# Altium schematic sheet TLogicWindow.schDOC
size A3; Organization: Altium Limited; Address1: L3, 12a Rodborough Rd; Address2: Frenchs Forest; Address3: NSW; Address4: Australia 2086; DocumentNumber: 12; SheetNumber: 12; SheetTotal: 22
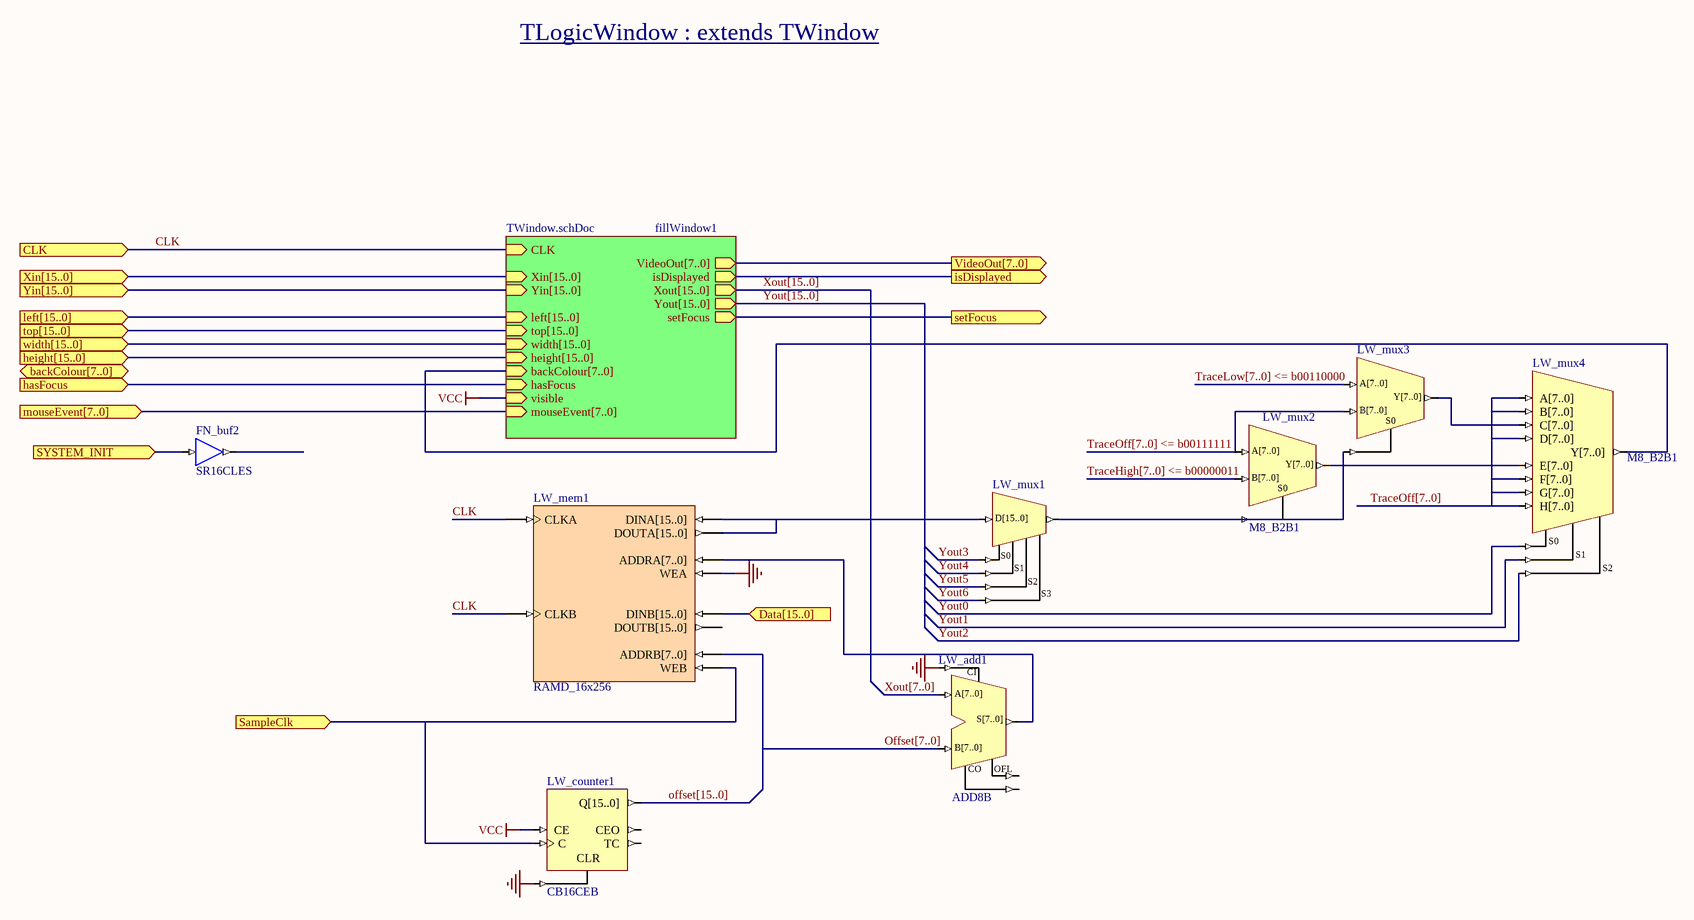
[diagram p0: TLogicWindow.schDOC]

## Parts
FN_buf2  SR16CLES
LW_add1  ADD8B
LW_counter1  CB16CEB
LW_mem1  RAMD_16x256
LW_mux1  M1_B16S1  (value not drawn)
LW_mux2  M8_B2B1
LW_mux3  M8_B2B1  (value not drawn)
LW_mux4  M8_B2B1

## Sub-sheets
fillWindow1 = TWindow.schDoc: CLK (in), VideoOut[7..0] (out), Xin[15..0] (in), Yin[15..0] (in), top[15..0] (in), width[15..0] (in), height[15..0] (in), left[15..0] (in), Xout[15..0] (out), Yout[15..0] (out), backColour[7..0] (in), isDisplayed (out), visible (in), hasFocus (in), mouseEvent[7..0] (in), setFocus (out)

## Ports
backColour[7..0] (in), CLK (in), Data[15..0] (in), hasFocus (in), height[15..0] (in), isDisplayed (out), left[15..0] (in), mouseEvent[7..0] (in), SampleClk (in), setFocus (out), SYSTEM_INIT (in), top[15..0] (in), VideoOut[7..0] (out), width[15..0] (in), Xin[15..0] (in), Yin[15..0] (in)

## Nets
GND: LW_add1.CI LW_counter1.CLR LW_mem1.WEA
VCC: LW_counter1.CE ; sheet fillWindow1/visible
CLK: LW_mem1.CLKA LW_mem1.CLKB ; port CLK, sheet fillWindow1/CLK
Data[15..0]: LW_mem1.DINB[15..0] ; port Data[15..0]
hasFocus: port hasFocus, sheet fillWindow1/hasFocus
isDisplayed: port isDisplayed, sheet fillWindow1/isDisplayed
Offset[7..0]: LW_add1.B[7..0] LW_mem1.ADDRB[7..0]
offset[15..0]: LW_counter1.Q[15..0]
SampleClk: LW_counter1.C LW_mem1.WEB ; port SampleClk
setFocus: port setFocus, sheet fillWindow1/setFocus
SYSTEM_INIT: FN_buf2.I ; port SYSTEM_INIT
TraceHigh[7..0] <= b00000011: LW_mux2.B[7..0]
TraceLow[7..0] <= b00110000: LW_mux3.A[7..0]
TraceOff[7..0]: LW_mux4.A[7..0] LW_mux4.B[7..0] LW_mux4.D[7..0] LW_mux4.F[7..0] LW_mux4.G[7..0] LW_mux4.H[7..0]
TraceOff[7..0] <= b00111111: LW_mux2.A[7..0] LW_mux3.B[7..0]
Xout[7..0]: LW_add1.A[7..0]
Yout0: LW_mux4.S0
Yout1: LW_mux4.S1
Yout2: LW_mux4.S2
Yout3: LW_mux1.S0
Yout4: LW_mux1.S1
Yout5: LW_mux1.S2
Yout6: LW_mux1.S3
NetLW_add1_S[7..0]: LW_add1.S[7..0] LW_mem1.ADDRA[7..0]
NetLW_mem1_DINA[15..0]: LW_mem1.DINA[15..0] LW_mem1.DOUTA[15..0] LW_mux1.D[15..0]
NetLW_mux1_O: LW_mux1.O LW_mux2.S0 LW_mux3.S0
NetLW_mux2_Y[7..0]: LW_mux2.Y[7..0] LW_mux4.E[7..0]
NetLW_mux3_Y[7..0]: LW_mux3.Y[7..0] LW_mux4.C[7..0]
NetLW_mux4_Y[7..0]: LW_mux4.Y[7..0] ; sheet fillWindow1/backColour[7..0]

Not connected (* = marked no-connect by the designer): FN_buf2 O; LW_add1 CO OFL; LW_counter1 CEO TC; LW_mem1 DOUTB[15..0]

## Buses and harness runs
bus Offset[7..0]
bus offset[15..0]
bus port height[15..0] = sheet fillWindow1/height[15..0]
bus port left[15..0] = sheet fillWindow1/left[15..0]
bus port mouseEvent[7..0] = sheet fillWindow1/mouseEvent[7..0]
bus port top[15..0] = sheet fillWindow1/top[15..0]
bus port VideoOut[7..0] = sheet fillWindow1/VideoOut[7..0]
bus port width[15..0] = sheet fillWindow1/width[15..0]
bus port Xin[15..0] = sheet fillWindow1/Xin[15..0]
bus port Yin[15..0] = sheet fillWindow1/Yin[15..0]
bus TraceHigh[7..0] <= b00000011
bus TraceLow[7..0] <= b00110000
bus TraceOff[7..0]
bus TraceOff[7..0] <= b00111111
bus Xout[7..0]
bus Xout[15..0] = sheet fillWindow1/Xout[15..0]
bus Yout[15..0] = sheet fillWindow1/Yout[15..0]

## Notes on the sheet
- TLogicWindow : extends TWindow
- Title
- Size:
- Date:
- A3
- Number:
- Time:
- Revision:
- Sheet
- of
- File:

## Library data of the parts
FN_buf2 = BUF: 1-bit General Purpose (Non-inverting) Buffer; ArchiveName: GENERIC; Published: 9-30-2003; Publisher: Altium Limited; Xilinx Equivalent: BUF; Core Revision: 1.00.00
LW_add1 = ADD8B: 8-Bit Cascadable Full Adder with Carry In, Carry Out and Overflows, Bus Version; Xilinx Equivalent: ADD8; ArchiveName: GENERIC; Published: 9-30-2003; Publisher: Altium Limited; Core Revision: 1.00.00
LW_counter1 = CB16CEB: 16-Bit Cascadable Binary Counters with Clock Enable and Asynchronous Clear, Bus Version; Xilinx Equivalent: CB16CE; ArchiveName: GENERIC; Published: 9-30-2003; Publisher: Altium Limited; Core Revision: 1.00.00
LW_mem1 = RAMD_16x256: Dual Port Random Access Memory; Memory_DepthA: 256; Memory_Type: RAM_DualPortBlock; Memory_WidthA: 16; Memory_ClockEdge: Rising; Nexus_Core: Memory_Program; Published: 13/01/2004; Publisher: Altium Hobart Technology Center; Memory_DepthB: 256; Memory_WidthB: 16
LW_mux1 = M1_B16S1: 1x16-Bit Bus to 1x1-Single Wire Multiplexer; ArchiveName: GENERIC; Published: 9-30-2003; Publisher: Altium Limited; Core Revision: 1.00.00
LW_mux2 LW_mux3 = M8_B2B1: 2x8-Bit Bus to 1x8-Bit Bus Multiplexer; ArchiveName: GENERIC; Published: 9-30-2003; Publisher: Altium Limited; Core Revision: 1.00.00
LW_mux4 = M8_B8B1: 8x8-Bit Bus to 1x8-Bit Bus Multiplexer; ArchiveName: GENERIC; Published: 9-30-2003; Publisher: Altium Limited; Core Revision: 1.00.00